# EAGLE design mrf89_v1.1 (EAGLE 6.5.0)
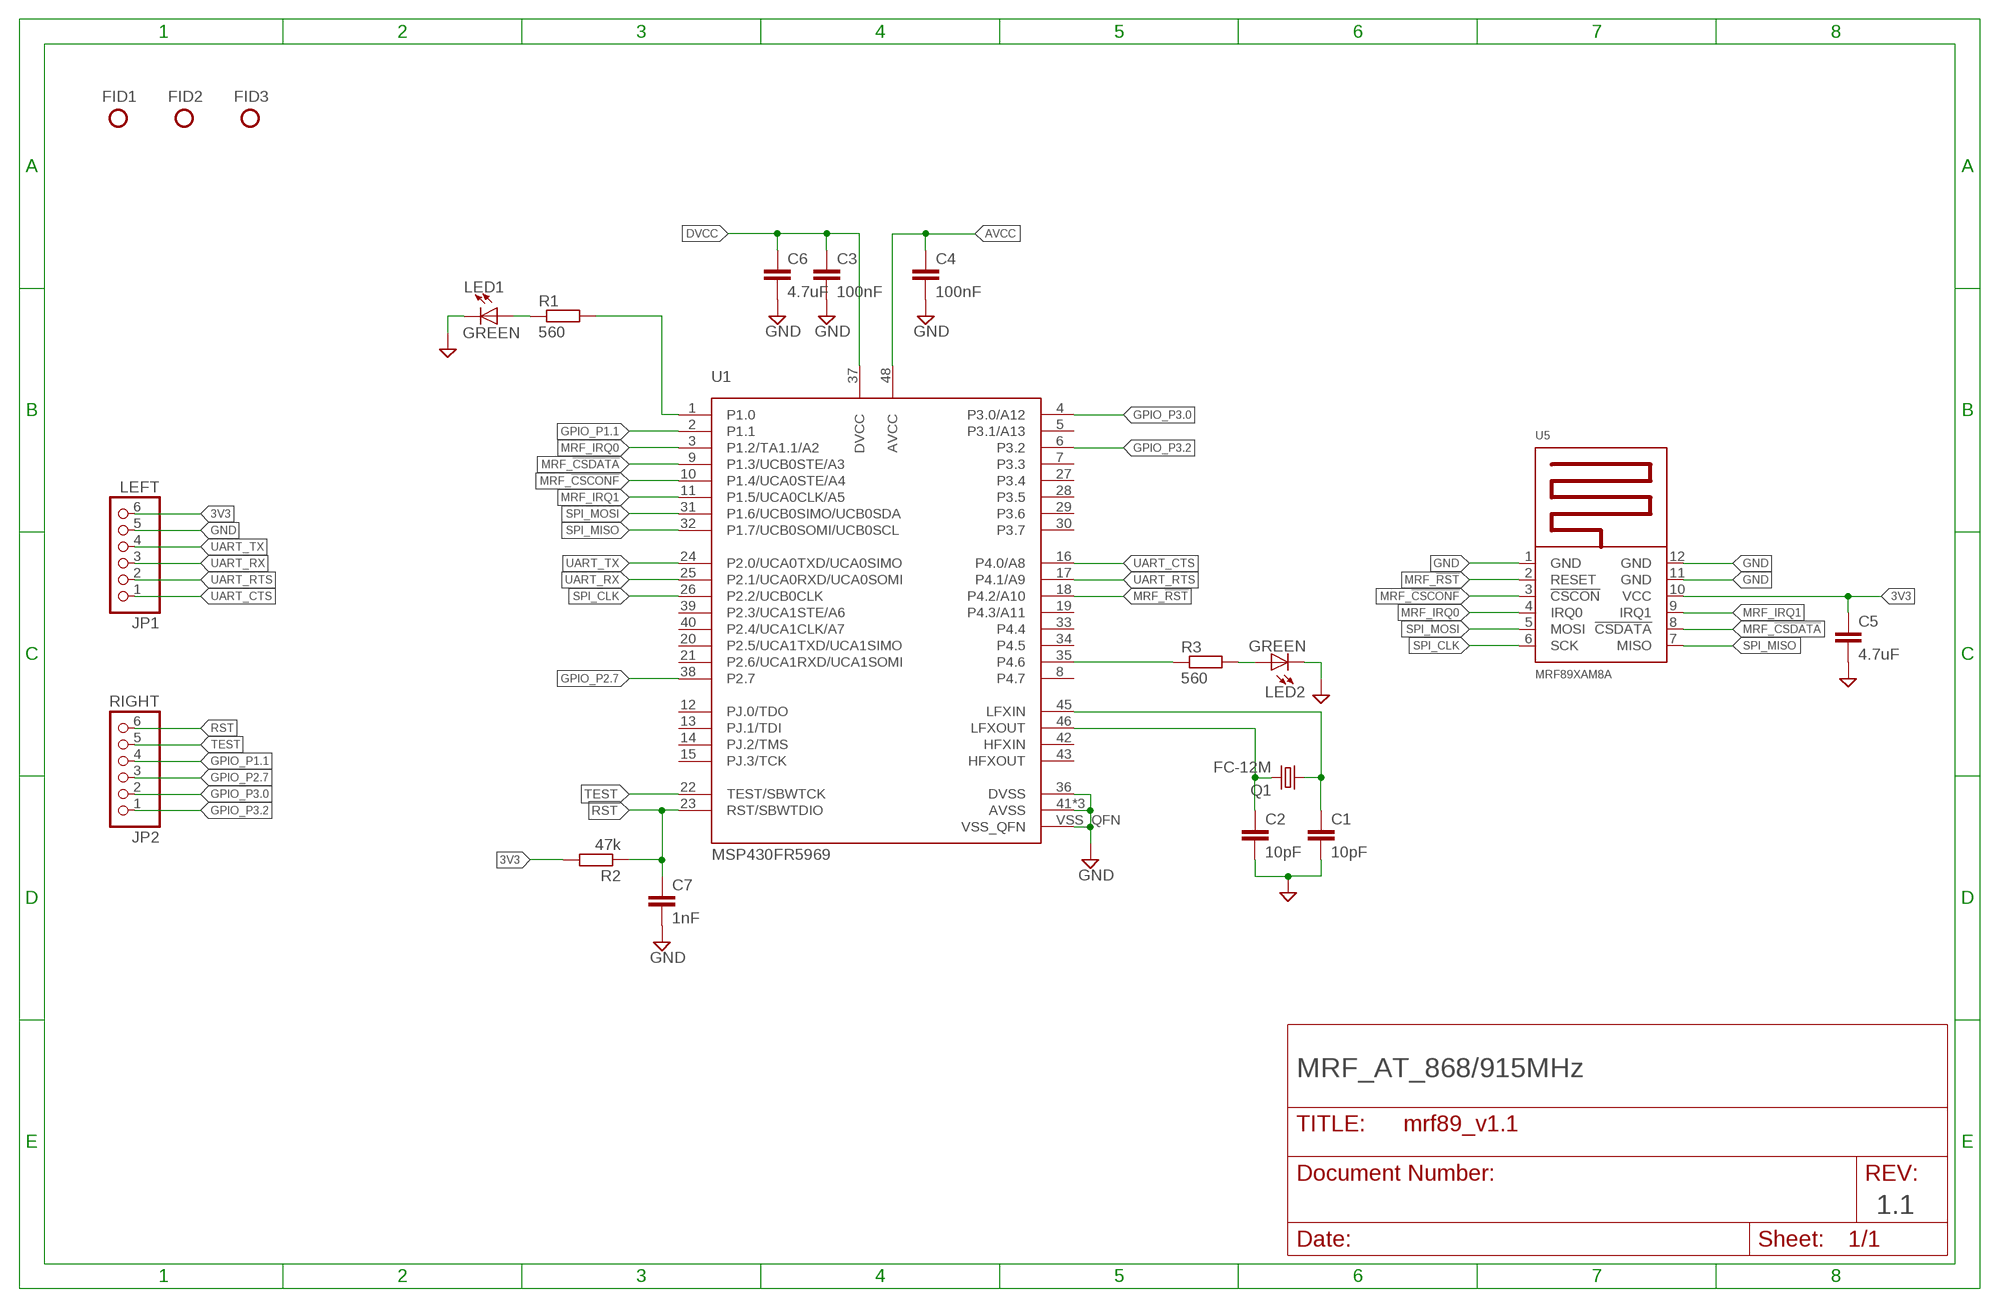
[diagram p0: schematic, sheet 1]

## Parts
C1  10pF  C-EUC0603  [C0603]
C2  10pF  C-EUC0603  [C0603]
C3  100nF  C-EUC0603  [C0603]
C4  100nF  C-EUC0603  [C0603]
C5  4.7uF  C-EUC0603  [C0603]
C6  4.7uF  C-EUC0603  [C0603]
C7  1nF  C-EUC0603  [C0603]
FID1  FIDUCIAL  [FIDUCIAL]
FID2  FIDUCIAL  [FIDUCIAL]
FID3  FIDUCIAL  [FIDUCIAL]
JP1  LEFT  PINHD-1X6  [1X06]
JP2  RIGHT  PINHD-1X6  [1X06]
LED1  GREEN  LEDCHIP-LED0603  [CHIP-LED0603]
LED2  GREEN  LEDCHIP-LED0603  [CHIP-LED0603]
Q1  FC-12M  [FC-12M]
R1  560  R-EU_R0603  [R0603]
R2  47k  R-EU_R0603  [R0603]
R3  560  R-EU_R0603  [R0603]
U1  MSP430FR5969  [S-PVQFN-N48]
U5  MRF89XAM8A  [MRF89XAMXA]

## Nets
3V3: C5.1 JP1.6 R2.2 U5.10(VCC)
AVCC: C4.1 U1.48(AVCC)
DVCC: C3.1 C6.1 U1.37(DVCC)
GND: C1.2 C2.2 C3.2 C4.2 C5.2 C6.2 C7.2 JP1.5 LED1.C LED2.C U1.36(DVSS) U1.41(AVSS) U1.44(AVSS) U1.47(AVSS) U1.VSS_QFN U5.1(GND) U5.11(GND) U5.12(GND)
GPIO_P1.1: JP2.4 U1.2(P1.1)
GPIO_P2.7: JP2.3 U1.38(P2.7)
GPIO_P3.0: JP2.2 U1.4(P3.0/A12)
GPIO_P3.2: JP2.1 U1.6(P3.2)
LFXIN: C1.1 Q1.1 U1.45(LFXIN)
LFXOUT: C2.1 Q1.2 U1.46(LFXOUT)
MRF_!CSCONF: U1.10(P1.4/UCA0STE/A4) U5.3(!CSCON)
MRF_!CSDATA: U1.9(P1.3/UCB0STE/A3) U5.8(!CSDATA)
MRF_!RST: U1.18(P4.2/A10) U5.2(RESET)
MRF_IRQ0: U1.3(P1.2/TA1.1/A2) U5.4(IRQ0)
MRF_IRQ1: U1.11(P1.5/UCA0CLK/A5) U5.9(IRQ1)
N$8: LED2.A R3.2
N$17: LED1.A R1.1
P1.0: R1.2 U1.1(P1.0)
P4.6: R3.1 U1.35(P4.6)
RST: C7.1 JP2.6 R2.1 U1.23(RST/SBWTDIO)
SPI_CLK: U1.26(P2.2/UCB0CLK) U5.6(SCK)
SPI_MISO: U1.32(P1.7/UCB0SOMI/UCB0SCL) U5.7(MISO)
SPI_MOSI: U1.31(P1.6/UCB0SIMO/UCB0SDA) U5.5(MOSI)
TEST: JP2.5 U1.22(TEST/SBWTCK)
UART_CTS: JP1.1 U1.16(P4.0/A8)
UART_RTS: JP1.2 U1.17(P4.1/A9)
UART_RX: JP1.3 U1.25(P2.1/UCA0RXD/UCA0SOMI)
UART_TX: JP1.4 U1.24(P2.0/UCA0TXD/UCA0SIMO)
Unconnected: U1.5(P3.1/A13) U1.7(P3.3) U1.8(P4.7) U1.12(PJ.0/TDO) U1.13(PJ.1/TDI) U1.14(PJ.2/TMS) U1.15(PJ.3/TCK) U1.19(P4.3/A11) U1.20(P2.5/UCA1TXD/UCA1SIMO) U1.21(P2.6/UCA1RXD/UCA1SOMI) U1.27(P3.4) U1.28(P3.5) U1.29(P3.6) U1.30(P3.7) U1.33(P4.4) U1.34(P4.5) U1.39(P2.3/UCA1STE/A6) U1.40(P2.4/UCA1CLK/A7) U1.42(HFXIN) U1.43(HFXOUT)

## Notes on the sheet
- MRF_AT_868/915MHz
- 1.1

## Library data of the parts
C1-C7 = rcl:C-EU: CAPACITOR, European symbol
FID1-FID3 = testpad:FIDUCIAL
JP1 JP2 = pinhead:PINHD-1X6: PIN HEADER
LED1 LED2 = led:LED: LED OSRAM: - CHIPLED LG R971, LG N971, LY N971, LG Q971, LY Q971, LO R971, LY R971 LH N974, LH R974 LS Q976, LO Q976, LY Q976 LO Q996 - Hyper CHIPLED LW Q18S LB Q993, LB Q99A, LB R99A - SideLED LS A670, LO A670, LY A670, LG A670, LP A670 LB A673, LV A673, LT A673, LW A673 LH A674 LY A675 LS A676, LA A676, LO A676, LY A676, LW A676 LS A679, LY A679, LG A679 - Hyper Micro SIDELED® LS Y876, LA Y876, LO Y876, LY Y876 LT Y87S - SmartLED LW L88C, LW L88S LB L89C, LB L89S, LG L890 LS L89K, LO L89K, LY L89K LS L896, LA L896, LO L896, LY L896 - TOPLED LS T670, LO T670, LY T670, LG T670, LP T670 LSG T670, LSP T670, LSY T670, LOP T670, LYG T670 LG T671, LOG T671, LSG T671 LB T673, LV T673, LT T673, LW T673 LH T674 LS T676, LA T676, LO T676, LY T676, LB T676, LH T676, LSB T676, LW T676 LB T67C, LV T67C, LT T67C, LS T67K, LO T67K, LY T67K, LW E67C LS E67B, LA E67B, LO E67B, LY E67B, LB E67C, LV E67C, LT E67C LW T67C LS T679, LY T679, LG T679 LS T770, LO T770, LY T770, LG T770, LP T770 LB T773, LV T773, LT T773, LW T773 LH T774 LS E675, LA E675, LY E675, LS T675 LS T776, LA T776, LO T776, LY T776, LB T776 LHGB T686 LT T68C, LB T68C - Hyper Mini TOPLED® LB M676 - Mini TOPLED Santana® LG M470 LS M47K, LO M47K, LY M47K Source: http://www.osram.convergy.de LUXEON: - LUMILED® LXK2-PW12-R00, LXK2-PW12-S00, LXK2-PW14-U00, LXK2-PW14-V00 LXK2-PM12-R00, LXK2-PM12-S00, LXK2-PM14-U00 LXK2-PE12-Q00, LXK2-PE12-R00, LXK2-PE12-S00, LXK2-PE14-T00, LXK2-PE14-U00 LXK2-PB12-K00, LXK2-PB12-L00, LXK2-PB12-M00, LXK2-PB14-N00, LXK2-PB14-P00, LXK2-PB14-Q00 LXK2-PR12-L00, LXK2-PR12-M00, LXK2-PR14-Q00, LXK2-PR14-R00 LXK2-PD12-Q00, LXK2-PD12-R00, LXK2-PD12-S00 LXK2-PH12-R00, LXK2-PH12-S00 LXK2-PL12-P00, LXK2-PL12-Q00, LXK2-PL12-R00 Source: www.luxeon.com KINGBRIGHT: KA-3528ASYC Source: www.kingbright.com
Q1 = crystal:FC-12M: kHz RANGE CRYSTAL UNIT LOW PROFILE SMD Source: Epson Toyocom FC-12M.pdf
R1-R3 = rcl:R-EU_: RESISTOR, European symbol
U1 = chips:MSP430FR5969
U5 = microchip_rf:MRF89XAM8A: Microchip MRF89XAM8A 868MHz Module

## Board
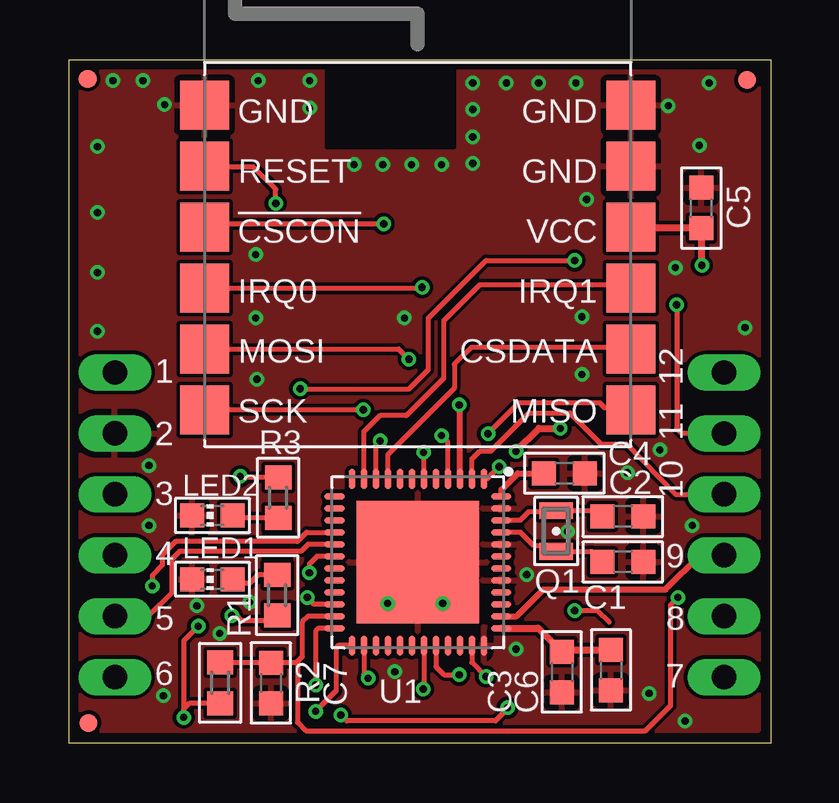
[diagram p1: board, top side]
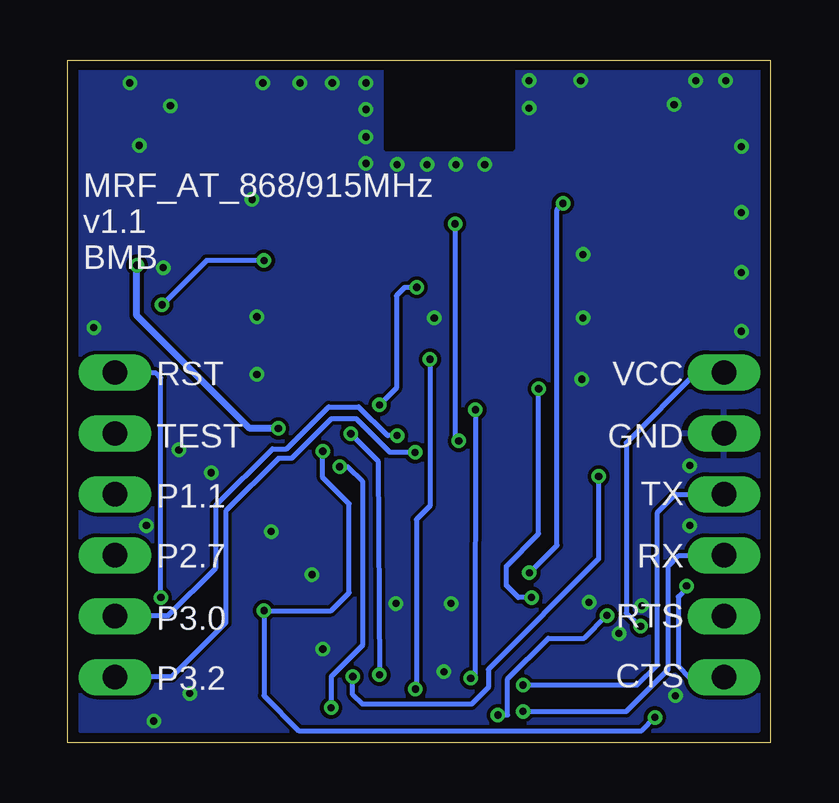
[diagram p2: board, bottom side, seen from below]

Size 29.29 x 28.46 mm. Coordinates in mm from the lower left corner, seen from the top.
Outline: 0,0 29.29,0 29.29,28.46 0,28.46 0,0
Copper layers (1*16): Top 0.035mm / dielectric 1.5mm / Bottom 0.035mm
Design rules "SeeedStudio_2layer_DRU_no_angle_20150228": minimum track width 6mil, minimum drill 0.3mm, track to track 6mil, track to pad 6mil, pad to pad 6mil, via to via 6mil, smd to smd 0mil, copper to edge 0.4mm, drill to drill 10mil, minimum pad ring 10mil, minimum via ring 6mil, stop-mask expansion 2mil, vias tented up to drill 100mil, thermal gap 10mil

### Footprints (pad centres in the part's own frame; a part is rotated, then mirrored left to right if it is on the bottom)
C0603 = smd 1 x 1: 1 -0.85,0; 2 0.85,0
FIDUCIAL = smd 0.75 x 0.75: TP 0,0
1X06 = drill 1.016 long: 1 -6.35,0; 2 -3.81,0; 3 -1.27,0; 4 1.27,0; 5 3.81,0; 6 6.35,0
CHIP-LED0603 = smd 1 x 1: A 0,-0.85; C 0,0.85
FC-12M = smd 0.7 x 1.4: 1 -0.85,0; 2 0.85,0
R0603 = smd 1 x 1.1: 1 -0.85,0; 2 0.85,0
S-PVQFN-N48 = smd 0.85 x 0.28: 1 -3.475,2.75; 2 -3.475,2.25; 3 -3.475,1.75; 4 -3.475,1.25; 5 -3.475,0.75; 6 -3.475,0.25; 7 -3.475,-0.25; 8 -3.475,-0.75; 9 -3.475,-1.25; 10 -3.475,-1.75; 11 -3.475,-2.25; 12 -3.475,-2.75; 25 3.475,-2.75; 26 3.475,-2.25; 27 3.475,-1.75; 28 3.475,-1.25; 29 3.475,-0.75; 30 3.475,-0.25; 31 3.475,0.25; 32 3.475,0.75; 33 3.475,1.25; 34 3.475,1.75; 35 3.475,2.25; 36 3.475,2.75 | smd 0.28 x 0.85: 13 -2.75,-3.475; 14 -2.25,-3.475; 15 -1.75,-3.475; 16 -1.25,-3.475; 17 -0.75,-3.475; 18 -0.25,-3.475; 19 0.25,-3.475; 20 0.75,-3.475; 21 1.25,-3.475; 22 1.75,-3.475; 23 2.25,-3.475; 24 2.75,-3.475; 37 2.75,3.475; 38 2.25,3.475; 39 1.75,3.475; 40 1.25,3.475; 41 0.75,3.475; 42 0.25,3.475; 43 -0.25,3.475; 44 -0.75,3.475; 45 -1.25,3.475; 46 -1.75,3.475; 47 -2.25,3.475; 48 -2.75,3.475 | smd 5.1 x 5.1: VSS_QFN 0,0
MRF89XAMXA = smd 2.032 x 2.032: 1 -8.89,-1.27; 2 -8.89,-3.81; 3 -8.89,-6.35; 4 -8.89,-8.89; 5 -8.89,-11.43; 6 -8.89,-13.97; 7 8.89,-13.97; 8 8.89,-11.43; 9 8.89,-8.89; 10 8.89,-6.35; 11 8.89,-3.81; 12 8.89,-1.27

### Placement (x,y rotation side)
C1  23.11,7.54 0 top
C2  23.11,9.43 0 top
C3  20.57,2.94 270 top
C4  20.68,11.23 0 top
C5  26.38,22.29 90 top
C6  22.61,3.02 270 top
C7  8.44,2.48 270 top
FID1  28.27,27.62 0 top
FID2  0.83,0.82 0 top
FID3  0.8,27.67 0 top
JP1  1.92,9.08 90 top
JP2  27.32,9.08 90 top
LED1  6,6.81 90 top
LED2  6,9.47 90 top
Q1  20.32,8.82 90 top
R1  8.7,6.15 270 top
R2  6.32,2.49 270 top
R3  8.73,10.21 270 top
U1  14.56,7.52 270 top
U5  14.55,27.84 0 top

### Tracks (layer width: path | path; a pad name or v marks a point on that pad's centre or on a via)
3V3  (via drill 0.3)
  Top 0.2: 22.54,5.01 22.05,5.5 v21.1,5.5 | R2.2 6.3,1.65 5.05,1.65 4.8,1.4 v4.8,1.05 4.8,4.25 v5.4,4.85
  Top 0.3: U5.10 23.5,21.44 C5.1 26.4,21.41 v26.4,19.9 | v18.65,12.15 19.6,13.1 v20.5,13.1
  Bottom 0.2: v18.65,12.15 18.65,11.05 17.55,9.95 17.55,6.25 18.3,5.5 v21.1,5.5 21.1,1.95 19.65,0.5 5.35,0.5 v4.8,1.05 | JP1.6 3.07,15.43 6,12.5 6,5.4 v5.4,4.85
  Bottom 0.3: v20.5,13.1 21.7,13.1 26.4,17.8 v26.4,19.9
AVCC
  Top 0.25: U1.48 18.04,10.54 18.73,11.22 C4.1
DVCC
  Top 0.3: U1.37 19.59,4.77 C3.1 20.64,3.87 C6.1
GND  (via drill 0.3)
  Top 0.2: v13.3,5.8 13.3,6.26 U1.VSS_QFN 15.6,6.48 v15.6,5.8
  other vias: 4,26.6 25,26.55 26.3,24.9 21.6,22.65 23.3,11.25 3.35,11.55 5.35,5.7 18.65,3.9 13.6,2.95 3.35,9.05 3.95,1.95 16.85,27.5 16.85,26.4 16.85,25.25 16.85,24.15 15.55,24.1 14.3,24.1 13.1,24.1 11.9,24.1 10.05,27.6 10.05,26.45 7.55,5.85 6.3,4.55 7.85,15.15 21.4,15.35 28.2,17.3 25.3,19.8 7.8,20.35 7.8,17.7 1.2,19.6 1.2,22.1 1.2,24.85 21.4,17.75 24.2,2.05 25.7,0.9 24.65,12.2 26,9.05 19.1,7 18.25,27.5 19.6,27.5 21.15,27.5 7.9,27.6 3.1,27.6 1.85,27.6 1.2,17.15 14,17.7 20.8,8.8 26.7,27.5
  pour Bottom: 0.5,0.5 0.5,28 28.75,28 28.75,0.5
  pour Top: 0.5,0.5 0.5,28 28.75,28 28.75,0.5
GPIO_P1.1
  Top 0.2: JP2.4 25.3,10.35 23.25,12.45 22.2,12.45 20.9,13.75 19.2,13.75 17.6,12.15 17.15,12.15 16.8,11.8 U1.2
GPIO_P2.7
  Top 0.25: JP2.3 27.3,7.83 26.34,7.83 24.89,6.38 19.79,6.38 18.68,5.27 U1.38
GPIO_P3.0  (via drill 0.3)
  Top 0.2: v15.55,12.8 15.8,12.54 U1.4
  Bottom 0.2: v15.55,12.8 15.95,12.8 17.15,14 18.4,14 20.15,12.25 20.75,12.25 23.1,9.9 23.1,7.29 25.09,5.3 27.29,5.3 JP2.2
GPIO_P3.2  (via drill 0.3)
  Top 0.2: v14.8,12.1 14.8,11.95 U1.6
  Bottom 0.2: v14.8,12.1 15.85,12.1 17.25,13.5 18.3,13.5 19.95,11.85 20.5,11.85 22.7,9.65 22.7,5 24.95,2.75 27.3,2.75 JP2.1
LFXIN
  Top 0.2: C1.1 21.82,7.97 Q1.1 20.07,8.23 19.39,8.23 18.84,8.77 U1.45
LFXOUT
  Top 0.2: C2.1 22.02,9.67 Q1.2 20.29,9.63 19.18,9.63 18.82,9.27 U1.46
MRF_!CSCONF  (via drill 0.3)
  Top 0.2: U5.3 5.8,21.63 v13.13,21.63 | v12.98,12.58 12.79,12.38 12.79,11.02 U1.10
  Bottom 0.2: v13.13,21.63 13.13,12.73 v12.98,12.58
MRF_!CSDATA
  Top 0.2: U5.8 23.38,16.48 16.79,16.48 16.09,15.78 16.09,14.78 13.3,12 U1.9
MRF_!RST  (via drill 0.3)
  Top 0.2: v8.63,22.48 8.63,23.07 7.7,24 5.7,24 U5.2 | v10.04,7.08 10.04,7.46 10.35,7.77 U1.18
  Bottom 0.2: v8.63,22.48 8.88,22.23 8.88,8.23 v10.04,7.08
MRF_IRQ0  (via drill 0.3)
  Top 0.2: U5.4 14.71,18.95 v14.73,18.98
  Top 0.25: U1.3 16.31,14.05 v16.29,14.08
  Bottom 0.2: v14.73,18.98 15.23,18.98 15.59,18.63 15.59,14.78 v16.29,14.08
MRF_IRQ1
  Top 0.2: U5.9 23.32,19.08 17.14,19.08 15.63,17.58 15.63,15.18 14.09,13.63 12.98,13.63 12.3,12.96 U1.11
N$1
  cutout Bottom: 10.75,28.25 10.75,24.75 16,24.75 16,28.25
N$8
  Top 0.2: R3.2 6.86,9.36 LED2.A
N$17
  Top 0.2: R1.1 7.91,7 7.54,6.63 6.78,6.63 LED1.A
P1.0  (via drill 0.3)
  Top 0.2: v17.95,11.5 17.45,10.99 U1.1 | v18.3,1.45 18.3,1.4 17.8,0.9 11.6,0.9 v11.35,1.15 | v6.8,5.3 7,5.3 7.2,5.1 8.5,5.1 R1.2
  Bottom 0.2: v17.95,11.5 17.6,11.5 17,10.9 17,4.05 18.3,2.75 v18.3,1.45 | v11.35,1.15 10.95,1.15 10.95,2.65 9.25,4.35 7.75,4.35 v6.8,5.3
P4.6  (via drill 0.3)
  Top 0.2: R3.1 7.19,11.06 v7.15,11.1 | U1.35 16.81,3.34 v17.4,2.75
  Bottom 0.2: v7.15,11.1 7.15,7.65 11.75,3.05 11.75,2.3 12.45,1.6 17,1.6 17.4,2 v17.4,2.75
RST  (via drill 0.3)
  Top 0.2: 9.48,3.33 9.73,3.58 9.73,5.03 9.97,5.27 U1.23 | 9.48,3.33 C7.1 6.72,3.33 R2.1 | v25.4,6.05 25.1,5.75 25.1,1.55 24.05,0.5 9.88,0.5 9.54,0.84 9.54,3.33 9.48,3.33
  Bottom 0.2: v25.4,6.05 25.4,15.2 25.6,15.4 27.29,15.4 JP2.6
SPI_CLK  (via drill 0.3)
  Top 0.2: U5.6 5.67,13.88 v12.29,13.88 | 12.3,2.85 v12.48,2.68 12.31,2.85 U1.26
  Bottom 0.2: v12.29,13.88 12.3,2.85 v12.47,2.68 v12.48,2.68
SPI_MISO  (via drill 0.3)
  Top 0.2: v17.48,12.88 18.77,14.17 22.13,14.17 22.33,13.97 23.34,13.97 U5.7 | U1.32 15.31,3.17 15.65,2.83 v16.28,2.83 v16.29,2.83
  Bottom 0.2: v17.48,12.88 17.33,12.73 16.35,11.75 v16.29,2.83
SPI_MOSI  (via drill 0.3)
  Top 0.2: U5.5 13.76,16.41 v14.19,15.98 | U1.31 14.81,2.25 v14.79,2.23
  Bottom 0.2: v14.19,15.98 14.19,9.87 14.75,9.3 14.73,2.28 v14.79,2.23
TEST  (via drill 0.3)
  Top 0.2: v9.65,14.75 14.2,14.75 15,15.55 15,17.7 17.4,20.1 v21.1,20.1 | v25.35,18.25 25.35,13.1 25.55,12.9 JP2.5 | U1.22 10.23,5.77 v9.95,6.05
  Bottom 0.2: v9.95,6.05 10.5,6.05 11,6.55 11,7.35 9.65,8.7 v9.65,14.75 | v21.1,20.1 23.5,20.1 v25.35,18.25
UART_CTS  (via drill 0.3)
  Top 0.2: v3.48,6.53 3.48,6.98 3.9,7.4 3.9,7.83 4.45,8.38 9.54,8.38 9.93,8.77 U1.16
  Bottom 0.2: v3.48,6.53 3.48,6.43 3.83,6.08 3.83,3.18 3.38,2.73 JP1.1
UART_RTS
  Top 0.2: JP1.2 1.94,5.28 3.33,5.28 4.29,6.23 4.29,7.63 4.64,7.98 9.69,7.98 9.97,8.27 U1.17
UART_RX  (via drill 0.3)
  Top 0.2: U1.25 11.24,4.04 11.15,3.95 11.15,2.15 v10.3,1.3
  Bottom 0.2: v10.3,1.3 6,1.3 4.25,3.05 4.25,7.35 3.8,7.8 1.94,7.8 JP1.3
UART_TX  (via drill 0.3)
  Top 0.2: U1.24 10.42,4.77 10.3,4.65 v10.3,2.4
  Bottom 0.2: v10.3,2.4 5.55,2.4 4.7,3.25 4.7,9.6 3.95,10.35 JP1.4

### Text on the board
tNames: 1 | 12 | 11 | 2 | 3 | 10 | 4 | 9 | 5 | 8 | 6 | 7
bNames: MRF_AT_868/915MHz / v1.1 / BMB | VCC | RST | GND | TEST | TX | P1.1 | RX | P2.7 | RTS | P3.0 | CTS | P3.2